# Altium schematic sheet LM2596.SchDoc
size A4
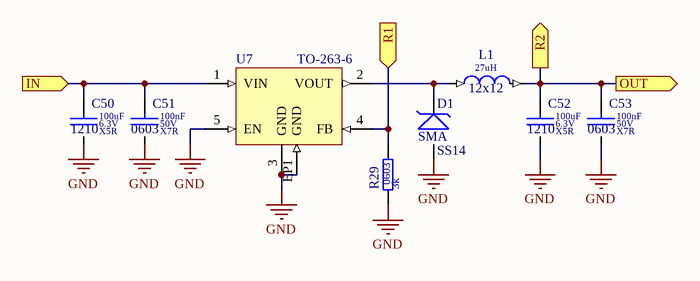
[diagram p0: LM2596.SchDoc]

## Parts
C50  value 100uF  Dielectric: X5R  Voltage: 6.3V  SCH_Footprint: 1210  [C_1210_3225]  (hidden comment: Ceramic X5R)
C51  value 100nF  Dielectric: X7R  Voltage: 50V  SCH_Footprint: 0603  [C_0603_1608]  (hidden comment: Ceramic X7R)
C52  value 100uF  Dielectric: X5R  Voltage: 6.3V  SCH_Footprint: 1210  [C_1210_3225]  (hidden comment: Ceramic X5R)
C53  value 100nF  Dielectric: X7R  Voltage: 50V  SCH_Footprint: 0603  [C_0603_1608]  (hidden comment: Ceramic X7R)
D1  SCH_Footprint: SMA  [SMA_DO-214AC]  (hidden comment: SS14)
L1  value 27uH  SCH_Footprint: 12x12  [L_SRR1280-XXXY]  (hidden comment: Inductor)
R29  value 3k  SCH_Footprint: 0603  [R_NC_0603_1608]  (hidden comment: Resistor)
U7  VR_LM2596  [TO-263-6]  (value not drawn)

## Ports
IN (in), OUT (out), R1 (in), R2 (out)

## Nets
GND: C50.2 C51.2 C52.2 C53.2 D1.2 R29.1 U7.3(GND) U7.5(EN) U7.EP1(GND)
IN: C50.1 C51.1 U7.1(VIN) ; port IN
OUT: C52.1 C53.1 L1.2 ; port R2, port OUT
R1: R29.2 U7.4(FB) ; port R1
NetD1_1: D1.1 L1.1 U7.2(VOUT)

## Library data of the parts
C50 C52 = C_100uF_6.3V_X5R_1210_20: Capacitor; Manufacturer: TDK; Manufacturer Part Number: C3225X5R0J107M250AC; Tolerance (%): 20; Part Number: C_100uF_6.3V_X5R_1210_20; HelpURL: https://datasheet.octopart.com/C3225X5R0J107M250AC-TDK-datasheet-41194876.pdf; Supplier 1: TME; Supplier 2: RS Components; Supplier Part Number 2: 7407685P; Supplier 3: Farnell; Supplier Part Number 3: 2522162; Supplier 4: Mouser; Supplier Part Number 4: 810-C3225X5R0J107M; Supplier 5: Digi-Key; Supplier Part Number 5: 445-1437-1-ND
C51 C53 = C_100nF_50V_X7R_0603_5: Capacitor; Manufacturer: Samsung; Manufacturer Part Number: CL10B104JB8NNNC; Tolerance (%): 5; Part Number: C_100nF_50V_X7R_0603_5; HelpURL: http://www.tme.eu/pl/Document/4a42202b32dab16128fe107dd69598cc/samsung-chip-cap.pdf; Supplier 1: TME; Supplier Part Number 1: CL10B104JB8NNNC; Supplier 2: RS Components; Supplier 3: Farnell; Supplier 4: Mouser; Supplier 5: Digi-Key
D1 = DS_SS14_1A_40V_SMA: Manufacturer: Fairchild Semiconductor; Voltage: 40V; Current: 1A; Value: SS14; Part Number: DS_SS14_1A_40V_SMA; HelpURL: https://www.vishay.com/docs/88746/ss12.pdf; Manufacturer Part Number: SS14; Supplier 1: TME; Supplier 2: RS Components; Supplier 3: Farnell; Supplier 4: Mouser; Supplier Part Number 4: 512-SS14; Supplier 5: Digi-Key; Supplier Part Number 5: SS14CT
L1 = L_27uH_3.9A_SRR1280: Induction; Manufacturer: Bourns; Manufacturer Part Number: SRR1280-270M; Current: 3.9A; Resistance: 52mR; Part Number: L_27uH_3.9A_SRR1280; HelpURL: https://www.bourns.com/pdfs/SRR1280.pdf; Supplier 1: TME; Supplier 2: RS Components; Supplier Part Number 2: 8749766P; Supplier 3: Farnell; Supplier Part Number 3: 2333859; Supplier 4: Mouser; Supplier Part Number 4: 652-SRR1280-270M; Supplier 5: Digi-Key
R29 = R_GENERIC_0603: Part Number: R_GENERIC_0603; Supplier 1: TME; Supplier 2: RS Components; Supplier 3: Farnell; Supplier 4: Mouser; Supplier 5: Digi-Key
U7 = VR_LM2596-ADJ: SCH_Footprint: TO-263-6; Part Number: VR_LM2596-ADJ; Supplier 1: TME; Supplier 2: RS Components; Supplier 3: Farnell; Supplier 4: Mouser; Supplier 5: Digi-Key